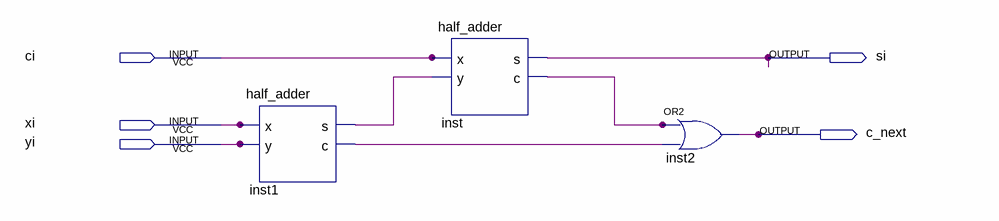
[diagram p0: schematic sheet]
// Quartus schematic full_adder.bdf as structural Verilog: 3 symbols, 5 pins
module full_adder (
  input  ci,
  input  xi,
  input  yi,
  output si,
  output c_next
);

  wire inst1_c, inst1_s, inst_c;

  half_adder inst1 (.x(xi), .y(yi), .s(inst1_s), .c(inst1_c));
  half_adder inst (.x(ci), .y(inst1_s), .s(si), .c(inst_c));
  or inst2 (c_next, inst_c, inst1_c);
endmodule
